# EAGLE design Final Project (EAGLE 8.2.2)
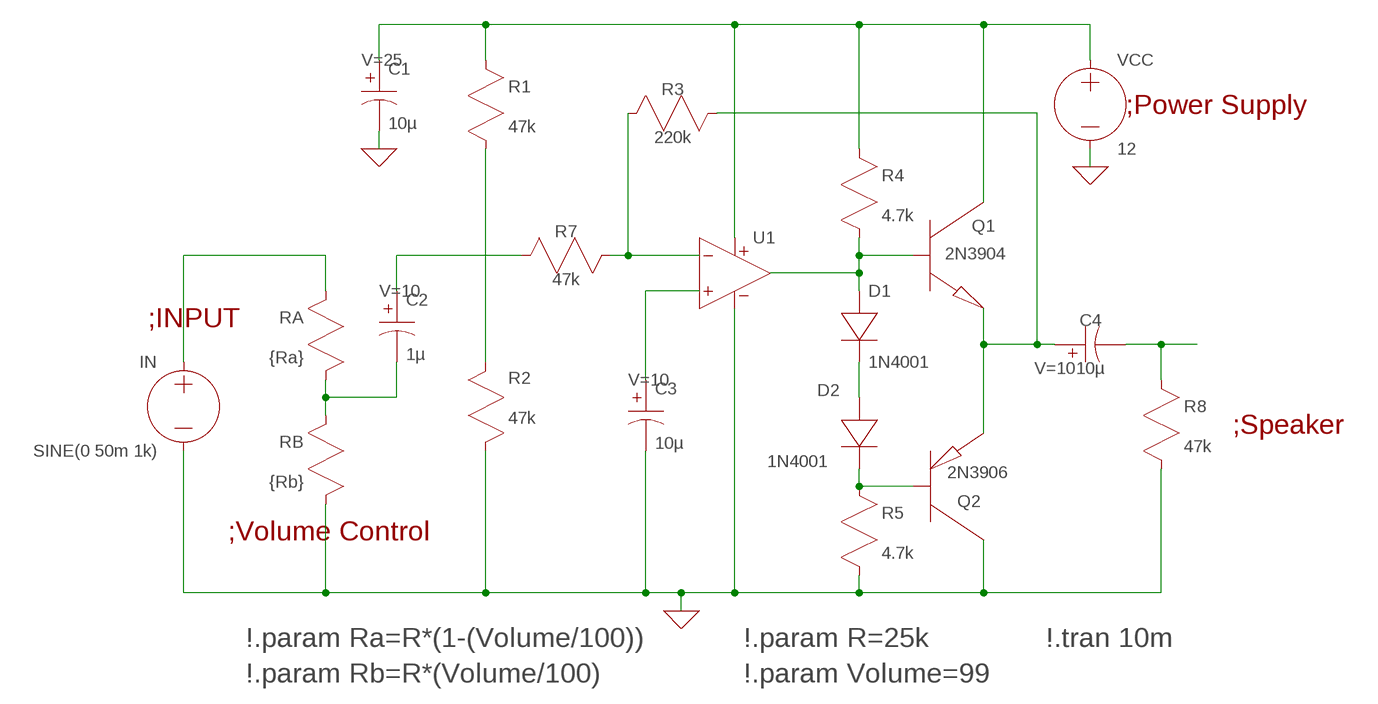
[diagram p0: schematic, sheet 1]

## Parts
C1  10µ  POLCAP  [PANASONIC_D]
C2  1µ  POLCAP  [PANASONIC_D]
C3  10µ  POLCAP  [PANASONIC_D]
C4  10µ  POLCAP  [PANASONIC_D]
D1  1N4001  DIODE  [SOD123]
D2  1N4001  DIODE  [SOD123]
IN  SINE(0 50m 1k)  VOLTAGE  (no package)
Q1  2N3904  NPN  [SOT23]
Q2  2N3906  PNP  [SOT23]
R1  47k  RES  [R0805]
R2  47k  RES  [R0805]
R3  220k  RES  [R0805]
R4  4.7k  RES  [R0805]
R5  4.7k  RES  [R0805]
R7  47k  RES  [R0805]
R8  47k  RES  [R0805]
RA  {Ra}  RES  [R0805]
RB  {Rb}  RES  [R0805]
U1  UNIVERSALOPAMP2  [S8]
VCC  12  VOLTAGE  (no package)

## Nets
0: C1.-(B) C3.-(B) IN.- Q2.3(C) R2.1(A) R5.2(B) R8.2(B) RB.2(B) U1.4(V-) VCC.-
N$1: C1.+(A) Q1.3(C) R1.1(A) R4.1(A) U1.8(V+) VCC.+
N$2: C4.+(A) Q1.1(E) Q2.1(E) R3.2(B)
N$3: IN.+ RA.1(A)
N$4: C2.+(A) R7.2(B)
N$5: R3.1(A) R7.1(A) U1.2(IN-)
N$6: D1.A(+) Q1.2(B) R4.2(B) U1.3(OUT)
N$7: C3.+(A) U1.1(IN+)
N$9: C4.-(B) R8.1(A)
N$10: R1.2(B) R2.2(B)
N$12: C2.-(B) RA.2(B) RB.1(A)
N$13: D1.C(-) D2.A(+)
N$14: D2.C(-) Q2.2(B) R5.1(A)

## Notes on the sheet
- ;Power Supply
- ;INPUT
- ;Speaker
- ;Volume Control
- \!.param Ra=R*(1-(Volume/100)) | \!.param R=25k | \!.tran 10m
- \!.param Rb=R*(Volume/100) | \!.param Volume=99

## Library data of the parts
C1 = sym:POLCAP: Polarized Capacitor; SPICELINE: V=25
C2-C4 = sym:POLCAP: Polarized Capacitor; SPICELINE: V=10
D1 D2 = sym:DIODE: Diode
IN VCC = lt-spice-simulation:VOLTAGE: Voltage Source, either DC, AC, PULSE, SINE, PWL, EXP, or SFFM
Q1 = sym:NPN: Bipolar NPN transistor
Q2 = sym:PNP: Bipolar PNP transistor
R1-R5 R7 R8 RA RB = sym:RES: A resistor
U1 = Opamps:UNIVERSALOPAMP2: Universal Opamp model that allows 4 different levels of simulation accuracy. See ./examples/Educational/UniversalOpamp2.asc for details. En and in are equivalent voltage and current noises. Enk and ink are the respective corner frequencies. Phimargin is used to set the 2nd pole or delay to the approximate phase margin for level.3a and level.3b. This version uses the new, experimental level 2 switch as the output devices.

## Board
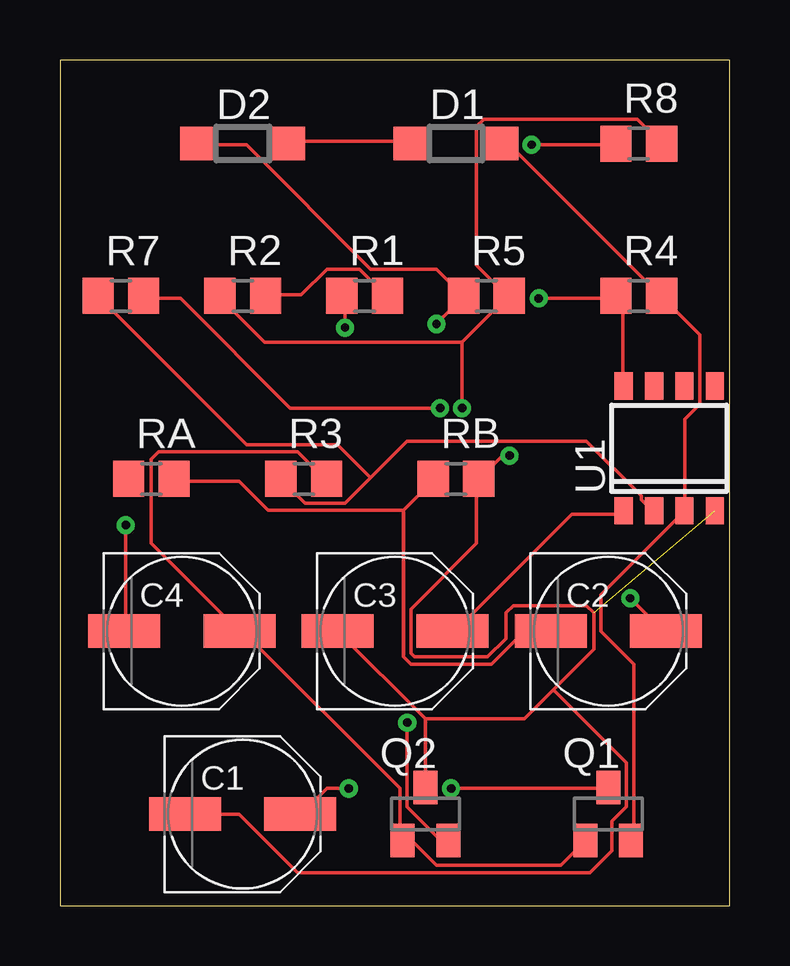
[diagram p1: board, top side]
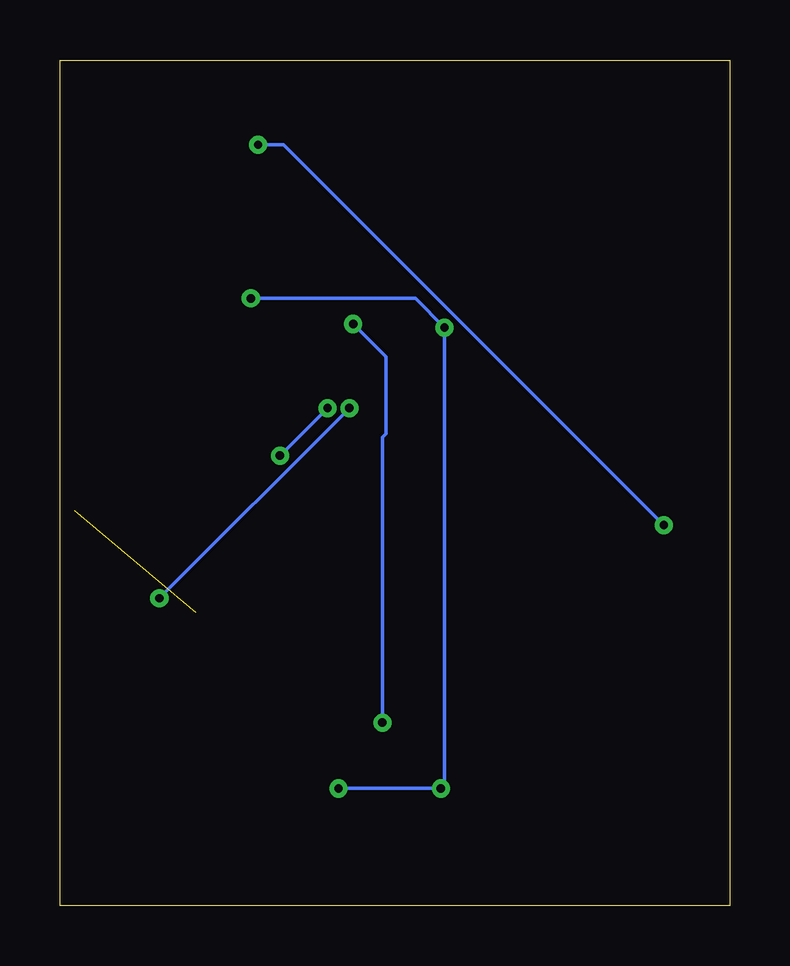
[diagram p2: board, bottom side, seen from below]

Size 27.92 x 35.23 mm. Coordinates in mm from the lower left corner, seen from the top.
Outline: 0,0 27.92,0 27.92,35.23 0,35.23 0,0
Copper layers (1*16): Top 0.035mm / dielectric 1.5mm / Bottom 0.035mm
Design rules "default": minimum track width 6mil, minimum drill 0.35mm, track to track 6mil, track to pad 6mil, pad to pad 6mil, via to via 6mil, smd to smd 6mil, copper to edge 40mil, drill to drill 6mil, minimum pad ring 10mil, minimum via ring 8mil, stop-mask expansion 4mil, vias tented up to drill 0mil, thermal gap 10mil

### Footprints (pad centres in the part's own frame; a part is rotated, then mirrored left to right if it is on the bottom)
PANASONIC_D = smd 3 x 1.4: + 2.4,0; - -2.4,0
SOD123 = smd 1.4 x 1.4: A 1.9,0; C -1.9,0
SOT23 = smd 1 x 1.4: 1 -0.95,-1.1; 2 0.95,-1.1; 3 0,1.1
R0805 = smd 1.3 x 1.5: 1 -0.95,0; 2 0.95,0
S8 = smd 0.762 x 1.143: 1 -1.905,-2.6; 2 -0.635,-2.6; 3 0.635,-2.6; 4 1.905,-2.6; 5 1.905,2.6; 6 0.635,2.6; 7 -0.635,2.6; 8 -1.905,2.6

### Placement (x,y rotation side)
C1  7.62,3.81 0 top
C2  22.86,11.43 0 top
C3  13.97,11.43 0 top
C4  5.08,11.43 0 top
D1  16.51,31.75 0 top
D2  7.62,31.75 0 top
Q1  22.86,3.81 0 top
Q2  15.24,3.81 0 top
R1  12.7,25.4 0 top
R2  7.62,25.4 0 top
R3  10.16,17.78 0 top
R4  24.13,25.4 0 top
R5  17.78,25.4 0 top
R7  2.54,25.4 0 top
R8  24.13,31.75 0 top
RA  3.81,17.78 0 top
RB  16.51,17.78 0 top
U1  25.4,19.05 0 top

### Tracks (layer width: path | path; a pad name or v marks a point on that pad's centre or on a via)
0  (via drill 0.35)  (1 unrouted)
  Top 0.152: 16.76,23.47 8.53,23.47 6.71,25.3 R2.1 | 16.76,23.47 18.59,25.3 R5.2 18.59,25.45 17.37,26.67 17.37,32.46 17.68,32.77 24.08,32.77 24.99,31.85 R8.2 | 15.24,7.77 Q2.3 | 15.24,7.77 11.58,11.43 C3.- | 20.57,8.99 19.36,7.77 15.24,7.77 | 20.57,8.99 22.25,10.67 22.25,12.19 21.95,12.5 18.9,12.5 18.59,12.19 18.59,11.12 17.83,10.36 14.78,10.36 14.63,10.52 14.63,12.34 17.37,15.09 17.37,17.68 RB.2 17.53,17.83 18.44,18.75 v18.75,18.75 | C1.- 7.47,3.81 9.91,1.37 22.1,1.37 23.01,2.29 23.01,3.5 23.62,4.12 23.62,5.94 20.57,8.99 | v16.76,20.73 16.76,23.47
  Bottom 0.152: v18.75,18.75 v16.76,20.73
N$1  (via drill 0.35)
  Top 0.152: U1.8 23.47,21.79 23.47,25.15 23.32,25.3 R4.1 23.16,25.3 v19.96,25.3 | v16.31,4.88 22.86,4.88 Q1.3 | v12.04,4.88 11.12,4.88 10.06,3.81 C1.+ | v11.89,24.08 11.89,25.3 R1.1
  Bottom 0.152: v16.31,4.88 v12.04,4.88 11.89,5.03 v11.89,24.08 13.11,25.3 v19.96,25.3
N$2
  Top 0.152: Q1.1 21.79,2.59 20.88,1.68 15.7,1.68 14.78,2.59 14.33,2.59 Q2.1 14.17,2.74 14.17,4.88 7.62,11.43 C4.+ 7.47,11.43 3.81,15.09 3.81,18.59 4.12,18.9 9.91,18.9 10.97,17.83 R3.2
N$4  (via drill 0.35)
  Top 0.152: v15.85,20.73 9.6,20.73 5.03,25.3 3.5,25.3 R7.2 | v23.77,12.8 25.15,11.43 C2.+
  Bottom 0.152: v23.77,12.8 v15.85,20.73
N$5
  Top 0.152: 12.95,17.83 11.89,16.76 10.21,16.76 9.3,17.68 R3.1 | 12.95,17.83 14.48,19.36 21.95,19.36 24.23,17.07 24.23,16.92 24.69,16.46 U1.2 | 12.95,17.83 11.58,19.2 7.77,19.2 1.68,25.3 R7.1
N$6
  Top 0.152: D1.A 18.44,31.7 18.75,31.7 24.99,25.45 R4.2 25.15,25.3 26.67,23.77 26.67,20.88 26.06,20.27 26.06,16.46 U1.3 25.91,16.31 22.55,12.95 22.55,11.43 23.93,10.06 23.93,2.74 Q1.2
N$7
  Top 0.152: U1.1 23.47,16.31 21.34,16.31 16.46,11.43 C3.+
N$9  (via drill 0.35)
  Top 0.152: v19.66,31.7 23.16,31.7 R8.1 | v2.74,15.85 2.74,11.43 C4.-
  Bottom 0.152: v19.66,31.7 18.59,31.7 v2.74,15.85
N$10
  Top 0.152: R2.2 8.69,25.45 10.06,25.45 11.12,26.52 12.5,26.52 13.56,25.45 R1.2
N$12
  Top 0.152: 14.33,16.46 8.69,16.46 7.47,17.68 4.88,17.68 RA.2 | 14.33,16.46 15.54,17.68 RB.1 | C2.- 19.36,11.43 17.98,10.06 14.63,10.06 14.33,10.36 14.33,16.46
N$13
  Top 0.152: D2.A 9.6,31.85 14.48,31.85 D1.C
N$14  (via drill 0.35)
  Top 0.152: D2.C 5.79,31.7 7.77,31.7 12.95,26.52 15.7,26.52 16.76,25.45 R5.1 16.76,25.3 v15.7,24.23 | v14.48,7.62 14.48,4.12 15.85,2.74 16.15,2.74 Q2.2
  Bottom 0.152: v14.48,7.62 14.48,19.51 14.33,19.66 14.33,22.86 v15.7,24.23